# Altium schematic sheet NET.SchDoc
size A3; Revision: 1.0; SheetNumber: 4; SheetTotal: 7
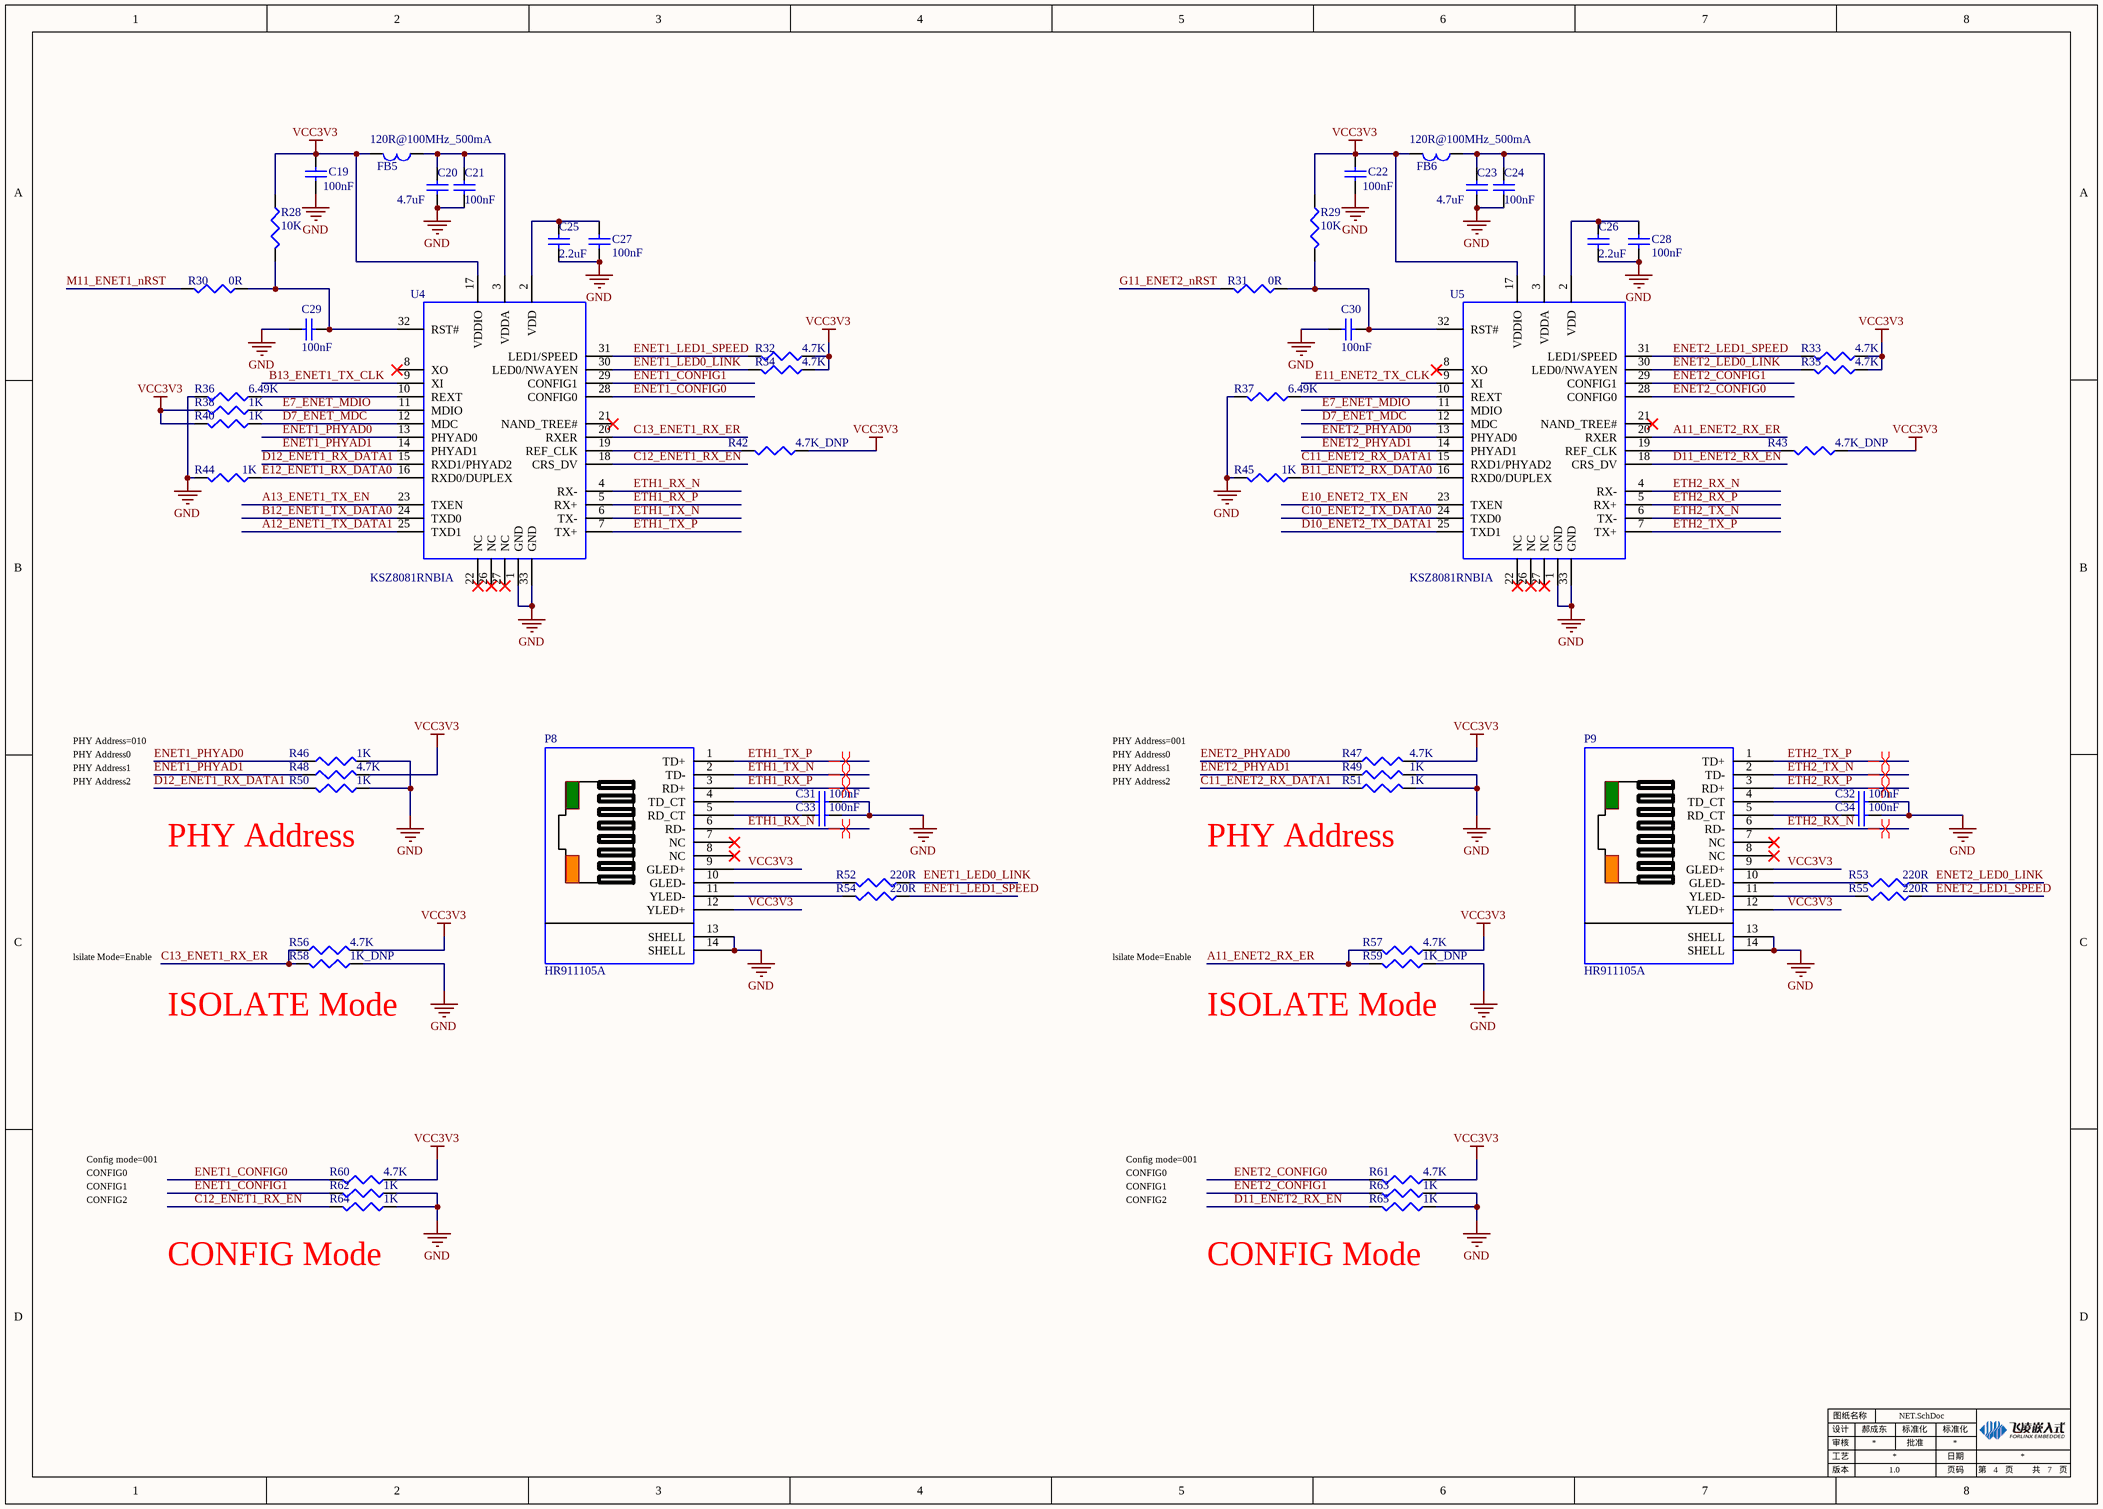
[diagram p0: NET.SchDoc]

## Parts
C19  100nF  [0603C+]
C20  4.7uF  [0603C+]
C21  100nF  [0603C+]
C22  100nF  [0603C+]
C23  4.7uF  [0603C+]
C24  100nF  [0603C+]
C25  2.2uF  [0603C+]
C26  2.2uF  [0603C+]
C27  100nF  [0603C+]
C28  100nF  [0603C+]
C29  100nF  [0603C+]
C30  100nF  [0603C+]
C31  100nF  [0603C+]
C32  100nF  [0603C+]
C33  100nF  [0603C+]
C34  100nF  [0603C+]
FB5  120R@100MHz_500mA  [0603R+]
FB6  120R@100MHz_500mA  [0603R+]
P8  HR911105A  [RJ-45A12]
P9  HR911105A  [RJ-45A12]
R28  10K  [0603R+]
R29  10K  [0603R+]
R30  0R  [0603R+]
R31  0R  [0603R+]
R32  4.7K  [0603R+]
R33  4.7K  [0603R+]
R34  4.7K  [0603R+]
R35  4.7K  [0603R+]
R36  6.49K  [0603R+]
R37  6.49K  [0603R+]
R38  1K  [0603R+]
R40  1K  [0603R+]
R42  4.7K_DNP  [0603R+]
R43  4.7K_DNP  [0603R+]
R44  1K  [0603R+]
R45  1K  [0603R+]
R46  1K  [0603R+]
R47  4.7K  [0603R+]
R48  4.7K  [0603R+]
R49  1K  [0603R+]
R50  1K  [0603R+]
R51  1K  [0603R+]
R52  220R  [0603R+]
R53  220R  [0603R+]
R54  220R  [0603R+]
R55  220R  [0603R+]
R56  4.7K  [0603R+]
R57  4.7K  [0603R+]
R58  1K_DNP  [0603R+]
R59  1K_DNP  [0603R+]
R60  4.7K  [0603R+]
R61  4.7K  [0603R+]
R62  1K  [0603R+]
R63  1K  [0603R+]
R64  1K  [0603R+]
R65  1K  [0603R+]
U4  KSZ8081RNBIA  [QFN-32]
U5  KSZ8081RNBIA  [QFN-32]

## Nets
GND: C19.2 C20.2 C21.2 C22.2 C23.2 C24.2 C25.2 C26.2 C27.2 C28.2 C29.1 C30.1 C31.1 C32.1 C33.1 C34.1 P8.13(SHELL) P8.14(SHELL) P9.13(SHELL) P9.14(SHELL) R36.2 R37.2 R44.2 R45.2 R46.2 R49.2 R50.1 R51.2 R58.1 R59.1 R62.1 R63.1 R64.1 R65.1 U4.1(GND) U4.33(GND) U5.1(GND) U5.33(GND)
VCC3V3: C19.1 C22.1 FB5.2 FB6.2 P8.9(GLED+) P8.12(YLED+) P9.9(GLED+) P9.12(YLED+) R28.1 R29.1 R32.1 R33.1 R34.1 R35.1 R38.2 R40.2 R42.1 R43.1 R47.2 R48.2 R56.2 R57.1 R60.1 R61.1 U4.17(VDDIO) U5.17(VDDIO)
A11_ENET2_RX_ER: R57.2 R59.2 U5.20(RXER)
A12_ENET1_TX_DATA1: U4.25(TXD1)
A13_ENET1_TX_EN: U4.23(TXEN)
B11_ENET2_RX_DATA0: R45.1 U5.16(RXD0/DUPLEX)
B12_ENET1_TX_DATA0: U4.24(TXD0)
B13_ENET1_TX_CLK: U4.9(XI)
C10_ENET2_TX_DATA0: U5.24(TXD0)
C11_ENET2_RX_DATA1: R51.1 U5.15(RXD1/PHYAD2)
C12_ENET1_RX_EN: R64.2 U4.18(CRS_DV)
C13_ENET1_RX_ER: R56.1 R58.2 U4.20(RXER)
D7_ENET_MDC: R40.1 U4.12(MDC) U5.12(MDC)
D10_ENET2_TX_DATA1: U5.25(TXD1)
D11_ENET2_RX_EN: R65.2 U5.18(CRS_DV)
D12_ENET1_RX_DATA1: R50.2 U4.15(RXD1/PHYAD2)
E7_ENET_MDIO: R38.1 U4.11(MDIO) U5.11(MDIO)
E10_ENET2_TX_EN: U5.23(TXEN)
E11_ENET2_TX_CLK: U5.9(XI)
E12_ENET1_RX_DATA0: R44.1 U4.16(RXD0/DUPLEX)
ENET1_CONFIG0: R60.2 U4.28(CONFIG0)
ENET1_CONFIG1: R62.2 U4.29(CONFIG1)
ENET1_LED0_LINK: R34.2 R52.1 U4.30(LED0/NWAYEN)
ENET1_LED1_SPEED: R32.2 R54.1 U4.31(LED1/SPEED)
ENET1_PHYAD0: R46.1 U4.13(PHYAD0)
ENET1_PHYAD1: R48.1 U4.14(PHYAD1)
ENET2_CONFIG0: R61.2 U5.28(CONFIG0)
ENET2_CONFIG1: R63.2 U5.29(CONFIG1)
ENET2_LED0_LINK: R35.2 R53.1 U5.30(LED0/NWAYEN)
ENET2_LED1_SPEED: R33.2 R55.1 U5.31(LED1/SPEED)
ENET2_PHYAD0: R47.1 U5.13(PHYAD0)
ENET2_PHYAD1: R49.1 U5.14(PHYAD1)
ETH1_RX_N: P8.6(RD-) U4.4(RX-)
ETH1_RX_P: P8.3(RD+) U4.5(RX+)
ETH1_TX_N: P8.2(TD-) U4.6(TX-)
ETH1_TX_P: P8.1(TD+) U4.7(TX+)
ETH2_RX_N: P9.6(RD-) U5.4(RX-)
ETH2_RX_P: P9.3(RD+) U5.5(RX+)
ETH2_TX_N: P9.2(TD-) U5.6(TX-)
ETH2_TX_P: P9.1(TD+) U5.7(TX+)
G11_ENET2_nRST: R31.2
M11_ENET1_nRST: R30.2
NetC20_1: C20.1 C21.1 FB5.1 U4.3(VDDA)
NetC23_1: C23.1 C24.1 FB6.1 U5.3(VDDA)
NetC25_1: C25.1 C27.1 U4.2(VDD)
NetC26_1: C26.1 C28.1 U5.2(VDD)
NetC29_2: C29.2 R28.2 R30.1 U4.32(RST#)
NetC30_2: C30.2 R29.2 R31.1 U5.32(RST#)
NetC31_2: C31.2 P8.4(TD_CT)
NetC32_2: C32.2 P9.4(TD_CT)
NetC33_2: C33.2 P8.5(RD_CT)
NetC34_2: C34.2 P9.5(RD_CT)
NetP8_10: P8.10(GLED-) R52.2
NetP8_11: P8.11(YLED-) R54.2
NetP9_10: P9.10(GLED-) R53.2
NetP9_11: P9.11(YLED-) R55.2
NetR36_1: R36.1 U4.10(REXT)
NetR37_1: R37.1 U5.10(REXT)
NetR42_2: R42.2 U4.19(REF_CLK)
NetR43_2: R43.2 U5.19(REF_CLK)

Not connected (* = marked no-connect by the designer): P8 7(NC)* 8(NC)*; P9 7(NC)* 8(NC)*; U4 8(XO)* 21(NAND_TREE#)* 22(NC)* 26(NC)* 27(NC)*; U5 8(XO)* 21(NAND_TREE#)* 22(NC)* 26(NC)* 27(NC)*

## Layout directives
differential pair: ETH1_RX_N, ETH1_RX_P, ETH1_TX_N, ETH1_TX_P, ETH2_RX_N, ETH2_RX_P, ETH2_TX_N, ETH2_TX_P

## Notes on the sheet
- PHY Address0
- PHY Address1
- PHY Address2
- PHY Address=010
- PHY Address=001
- PHY Address
- lsilate Mode=Enable
- ISOLATE Mode
- Config mode=001
- CONFIG0
- CONFIG1
- CONFIG2
- CONFIG Mode
- 设计
- 审核
- 工艺
- 图纸名称
- 郝成东
- 批准
- 标准化
- 日期
- 版本
- 页码
- 第
- 页
- 共

## Library data of the parts
C19-C34 = Cap: Capacitor; Published: 8-Jun-2000; LatestRevisionDate: 17-Jul-2002; LatestRevisionNote: Re-released for DXP Platform.; PackageReference: RAD-0.3; Publisher: Altium Limited; PackageDescription: Radial Cap, Thru-Hole; 2 Leads; 0.3 in Pin Spacing
  C19 C21 C22 C24 C27-C34: Value: 100nF
  C20 C23: Value: 4.7uF
  C25 C26: Value: 2.2uF
FB5 FB6 = CZ: Inductor; Code_IEC: 1005; Published: 8-Jun-2000; LatestRevisionDate: 29-May-2009; LatestRevisionNote: IPC-7351 Footprint Added.; PackageReference: 0402-A; Publisher: 120R@100MHz_500mA; PackageDescription: Chip Inductor; Code_JEITA: 0402; value: 120R@100MHz_500mA
R28-R38 R40 R42-R65 = Res3: Resistor; Published: 8-Jun-2000; LatestRevisionDate: 29-May-2009; LatestRevisionNote: IPC-7351 Footprint Added.; PackageReference: J1-0603; Publisher: Altium Limited; PackageDescription: Chip Resistor
  R28 R29: Value: 10K
  R30 R31: Value: 0R
  R32-R35 R47 R48 R56 R57 R60 R61: Value: 4.7K
  R36 R37: Value: 6.49K
  R38 R40 R44-R46 R49-R51 R62-R65: Value: 1K
  R42 R43: Value: 4.7K_DNP
  R52-R55: Value: 220R
  R58 R59: Value: 1K_DNP
U4 U5 = KSZ8081RNB